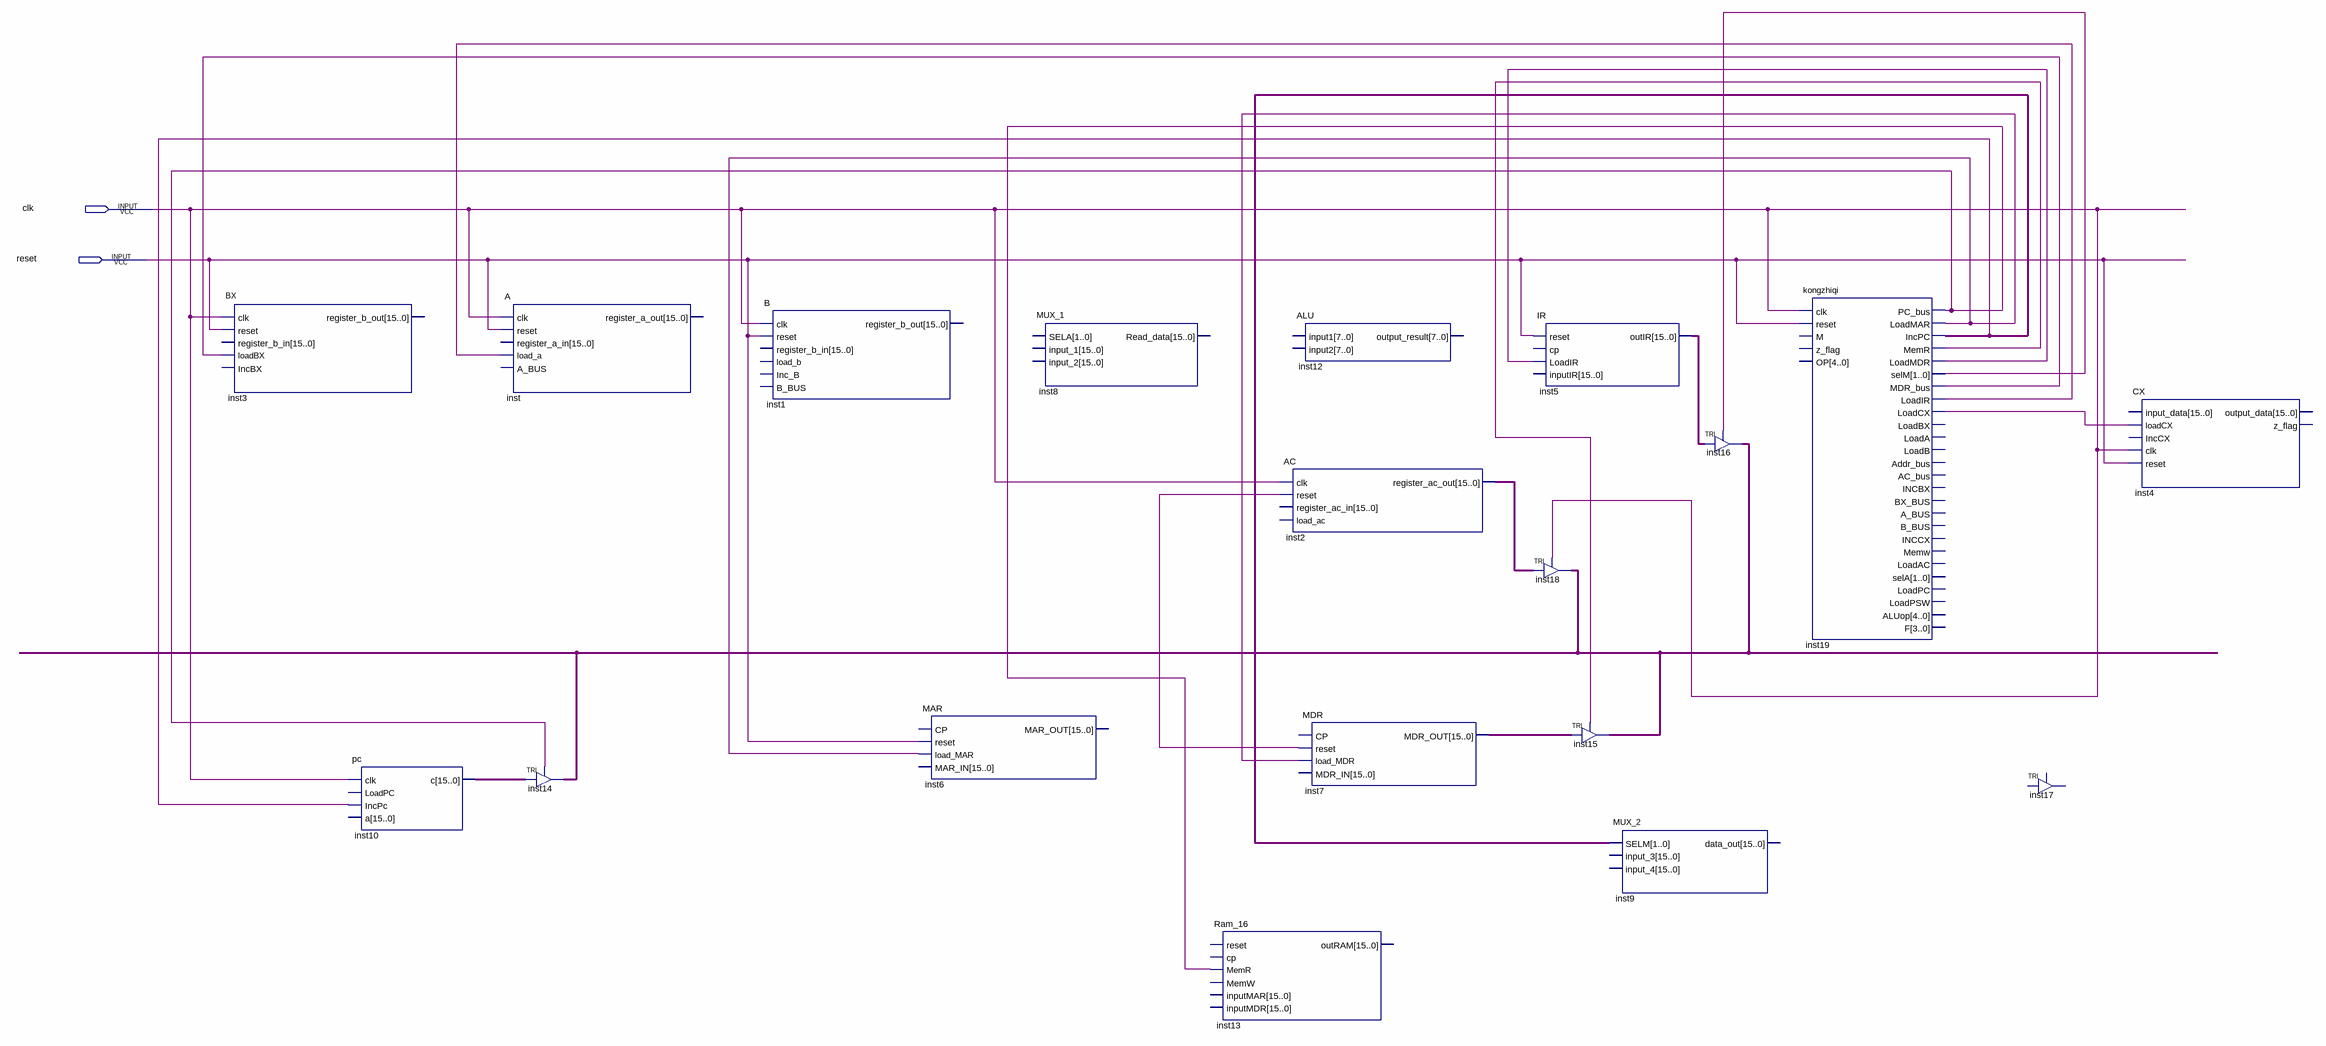
[diagram p0: schematic sheet]
// Quartus schematic Block1.bdf as structural Verilog: 19 symbols, 2 pins
module Block1 (
  input  clk,
  input  reset
);

  wire inst19_loadcx, inst19_loadir, inst19_loadmar, inst19_loadmdr, inst19_mdr_bus, inst19_memr,
       inst19_pc_bus, inst19_selm, undriven, undriven_2;
  wire [1:0] inst19_incpc;
  wire [15:0] inst2_register_ac_out, inst5_outir, inst7_mdr_out, inst10_c, inst14_out;

  BX inst3 (.clk(clk), .reset(reset), .loadBX(inst19_mdr_bus));  // open: register_b_in, IncBX, register_b_out
  pc inst10 (.clk(clk), .IncPc(undriven), .c(inst10_c));  // open: LoadPC, a
  A inst (.clk(clk), .reset(reset), .load_a(inst19_loadir));  // open: register_a_in, A_BUS, register_a_out
  TRI inst14[15:0] (.IN(inst10_c), .OE(inst19_pc_bus), .OUT(inst14_out));
  B inst1 (.clk(clk), .reset(reset));  // open: register_b_in, load_b, Inc_B, B_BUS, register_b_out
  MAR inst6 (.reset(reset), .load_MAR(inst19_loadmar));  // open: CP, MAR_IN, MAR_OUT
  MUX_1 inst8 ();  // open: SELA, input_1, input_2, Read_data
  Ram_16 inst13 (.MemR(inst19_pc_bus));  // open: reset, cp, MemW, inputMAR, inputMDR, outRAM
  AC inst2 (.clk(clk), .reset(undriven_2), .register_ac_out(inst2_register_ac_out));  // open: register_ac_in, load_ac
  ALU inst12 ();  // open: input1, input2, output_result
  MDR inst7 (.reset(undriven_2), .load_MDR(inst19_loadmar), .MDR_OUT(inst7_mdr_out));  // open: CP, MDR_IN
  IR inst5 (.reset(reset), .LoadIR(inst19_loadmdr), .outIR(inst5_outir));  // open: cp, inputIR
  TRI inst18[15:0] (.IN(inst2_register_ac_out), .OE(clk), .OUT(inst14_out));
  TRI inst15[15:0] (.IN(inst7_mdr_out), .OE(inst19_memr), .OUT(inst14_out));
  MUX_2 inst9 (.SELM(inst19_incpc));  // open: input_3, input_4, data_out
  TRI inst16[15:0] (.IN(inst5_outir), .OE(inst19_selm), .OUT(inst14_out));
  kongzhiqi inst19 (
    .clk(clk), .reset(reset), .PC_bus(inst19_pc_bus), .LoadMAR(inst19_loadmar), .IncPC(inst19_incpc),
    .MemR(inst19_memr), .LoadMDR(inst19_loadmdr), .selM(inst19_selm), .MDR_bus(inst19_mdr_bus),
    .LoadIR(inst19_loadir), .LoadCX(inst19_loadcx));  // open: M, z_flag, OP, LoadBX, LoadA, LoadB, Addr_bus, AC_bus, INCBX, BX_BUS, A_BUS, B_BUS, INCCX, Memw, LoadAC, selA, LoadPC, LoadPSW, ALUop, F
  TRI inst17 ();  // open: IN, OE, OUT
  CX inst4 (.loadCX(inst19_loadcx), .clk(clk), .reset(reset));  // open: input_data, IncCX, output_data, z_flag
endmodule
